# Altium project StenoBoard_L.PrjPcb
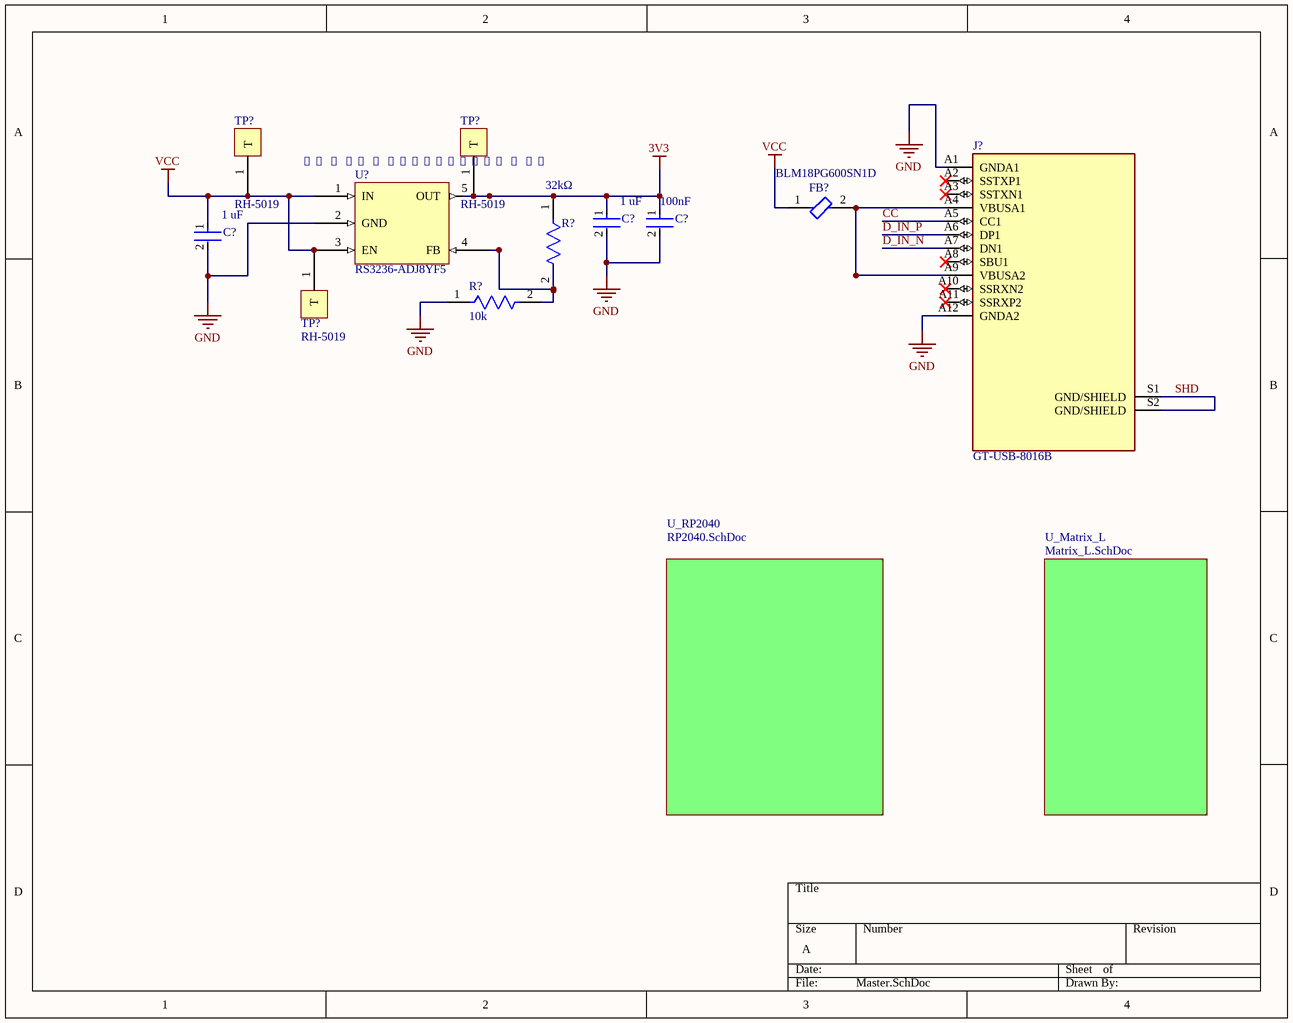
[diagram p0: Master.SchDoc]
3 sheets, 31 parts. Net scope: flat (ports and power ports of the same name join across sheets).
Sheets:
  Master.SchDoc
    U_Matrix_L = Matrix_L.SchDoc
    U_RP2040 = RP2040.SchDoc

## Sheet Master.SchDoc
size A; SheetNumber: 1; SheetTotal: 3

### Parts
(Parts that share a designator on the sheet are numbered #1, #2 ... from top to bottom, then left to right.)
C?#1  value 1 uF  [FP-CC0603-DA-MFG]  (hidden comment: CC0603KRX7R7BB105)
C?#2  Capacitance: 100nF  [FP-GRM155-0_05-MFG]  (hidden comment: GRM155R71C104KA88J)
C?#3  value 1 uF  [FP-CC0603-DA-MFG]  (hidden comment: CC0603KRX7R7BB105)
FB?  BLM18PG600SN1D  [FP-BLM18-0_15-t0_8-IPC_B]
J?  GT-USB-8016B  [BELFUSE_SS-52400-002]
R?#1  Resistance: 32kΩ  [FP-RT0603-0_55-MFG]  (hidden comment: RT0603BRD0732KL)
R?#2  Resistance: 10k  [FP-RC0603-0_55-IPC_C]  (hidden comment: RC0603FR-0710KL)
TP?#1  RH-5019  [RH-5019-Footprint-1]
TP?#2  RH-5019  [RH-5019-Footprint-1]
TP?#3  RH-5019  [RH-5019-Footprint-1]
U?#1  RS3236-ADJ8YF5  [SOT95P245X110-5N]

### Sub-sheets
U_Matrix_L = Matrix_L.SchDoc: no entries
U_RP2040 = RP2040.SchDoc: no entries

### Nets
3V3: C?#1.1 C?#2.1 R?#1.1 TP?#2.1(T) U?#1.5(OUT)
GND: C?#1.2 C?#2.2 C?#3.2 J?.A1(GNDA1) J?.A12(GNDA2) R?#2.1 U?#1.2(GND)
VCC: C?#3.1 FB?.1 TP?#1.1(T) TP?#3.1(T) U?#1.1(IN) U?#1.3(EN)
CC: J?.A5(CC1)
D_IN_N: J?.A7(DN1)
D_IN_P: J?.A6(DP1)
SHD: J?.S1(GND/SHIELD) J?.S2(GND/SHIELD)
NetFB?_2: FB?.2 J?.A4(VBUSA1) J?.A9(VBUSA2)
NetR?#1_2: R?#1.2 R?#2.2 U?#1.4(FB)

Not connected (* = marked no-connect by the designer): J? A2(SSTXP1)* A3(SSTXN1)* A8(SBU1)* A10(SSRXN2)* A11(SSRXP2)*

### Notes on the sheet
- 𝑅1 = 𝑅2 ∗ (VOUT/0.81 - 1)

### Library data of the parts
C?#1 C?#3 = CMP-03422-000924-1: CAP CER 1UF 16V X7R 0603; Manufacturer: YAGEO; Tolerance: 0.1; Temperature Coefficient: 15%; Material: Ceramic; Package: CC0603-DA; RoHS: TRUE; Device Class L2: Capacitors; Temperature Characteristic: X7R; Temperature: -55°C to +125°C; Temperature Range Low: -55°C; Automotive: No; ComponentLink2Description: Datasheet; Lead Free: Yes; Capacitance: 1 uF; ComponentLink2URL: http://www.yageo.com/documents/recent/UPY-GPHC_X7R_6.3V-to-50V_18.pdf; Device Class L1: Passive Components; Voltage: 16 V; Octopart: https://octopart.com/cc0603krx7r7bb105-yageo-42271928; Category: Cap; Digikey Description: CAP CER 1UF 16V X7R 0603; Footprint Url: http://www.yageo.com/exep/pages/download/literatures/UPY-C_GEN_24.pdf; Height: 0.9mm; Manufacturer Part Number: CC0603KRX7R7BB105; Voltage Rating: 16 V; Temperature Range High: +125°C; Mouser Description: Multilayer Ceramic Capacitor, CC Series, 1 - F, - 10%, X7R, 16 V, 0603 [1608 Metric]; Device Class L3: Ceramic Capacitors
C?#2 = CMP-2008-03928-2: NexarPartId: 9223238; Manufacturer Lifecycle Status: NRND; Voltage: 16V; Tolerance: 10%; Dielectric: X7R; Material: Ceramic; Schedule B: 8532240020, 8532240020; Mount: Surface Mount; Case/Package: 0402; Case Code (Imperial): 0402; Min Operating Temperature: -55°C; Length: 1mm; Voltage Rating (DC): 16V; Depth: 500µm; Lead Free: Lead Free; Max Operating Temperature: 125°C; Case Code (Metric): 1005; Radiation Hardening: No; Height: 550µm; Voltage Rating: 16V; Packaging: Cut Tape; RoHS: Compliant; Width: 500µm; Number of Pins: 2; REACH SVHC: No SVHC; Termination: SMD/SMT; Thickness: 500µm
FB? = CMP-0686-00575-3: Chip Ferrite Bead, 0603, 60Ω @ 100MHz, 0.1Ω, , 1A; ESR (Equivalent Series Resistance): 60R; Number of Lines: 1; Material: Steel; Tolerance: 25%; Shielding: Unshielded; Current Rating: 500mA; Resistance: 100mR; Package Quantity: 1; Termination: SMD/SMT; Lead Free: Lead Free; Max Operating Temperature: 125°C; Number of Circuits: 1; Length: 1.6mm; Min Operating Temperature: -55°C; Case Code (Metric): 1608; Max DC Current: 500mA; REACH SVHC: No SVHC; Frequency: 100MHz; Number of Pins: 2; RoHS Compliant: Yes; Height: 0.8mm; Depth: 0.8mm; Width: 0.8mm; Test Frequency: 100MHz; Case/Package: 0603; Impedance: 60R; Max Current Rating: 500mA; Packaging: Tape and Reel; DC Resistance (DCR): 100mR; Case Code (Imperial): 0603; Core Material: Ferrite
J? = CMP-002-00071-2: USB C 2.0 Plug
R?#1 = CMP-00621-34935746-1: RT0603BRD0732KL High Precision-High Stability Chip Resistor Thin Film 0603 32kOhm 0.1% Paper T/R; Temperature Coefficient: 25ppm/°C; Max Power Dissipation: 100mW; Case/Package: 0603; Composition: Thin Film; Features: Moisture Resistant; Packaging: Tape & Reel; RoHS: Compliant; Height: 558.8µm; Max Operating Temperature: 155°C; NexarPartId: 34935746; Number of Terminations: 2; Length: 1.6002mm; Width: 787.4µm; Tolerance: 0.1%; Min Operating Temperature: -55°C
R?#2 = CMP-2100-03664-2: RES 10K OHM 1% 1/10W 0603; Voltage Rating: 75V; Voltage Rating (DC): 50V; Power Rating: 100mW; Temperature Coefficient: 100ppm/°C; Depth: 0.8mm; Termination: SMD/SMT; Resistor Type: Thick Film; Series: RC; Construction: Rectangular; Features: Moisture Resistant; Packaging: Tape and Reel; Min Operating Temperature: -55°C; Number of Terminations: 2; Lead Pitch: 0.3mm; RoHS Compliant: Yes; Case/Package: 0603; Resistance Tolerance: 1%; Military Standard: Not; Weight: 7.1E-05oz; Number of Pins: 2; Tolerance: 1%; Length: 1.6mm; Case Code (Imperial): 0603; Lead Free: Lead Free; Width: 0.8mm; Max Power Dissipation: 100mW; Height: 0.45mm; Max Operating Temperature: 155°C; Case Code (Metric): 1608; Size Code: 0603
TP?#1-TP?#3 = CMP-00030-00001-2: PC Test Point
U?#1 = CMP-019-00049-2: IC Reg Lin Pos Adj 500MA SOT23-5

## Sheet Matrix_L.SchDoc
size A; SheetNumber: 2; SheetTotal: 2

## Sheet RP2040.SchDoc
size A; SheetNumber: 3; SheetTotal: 3
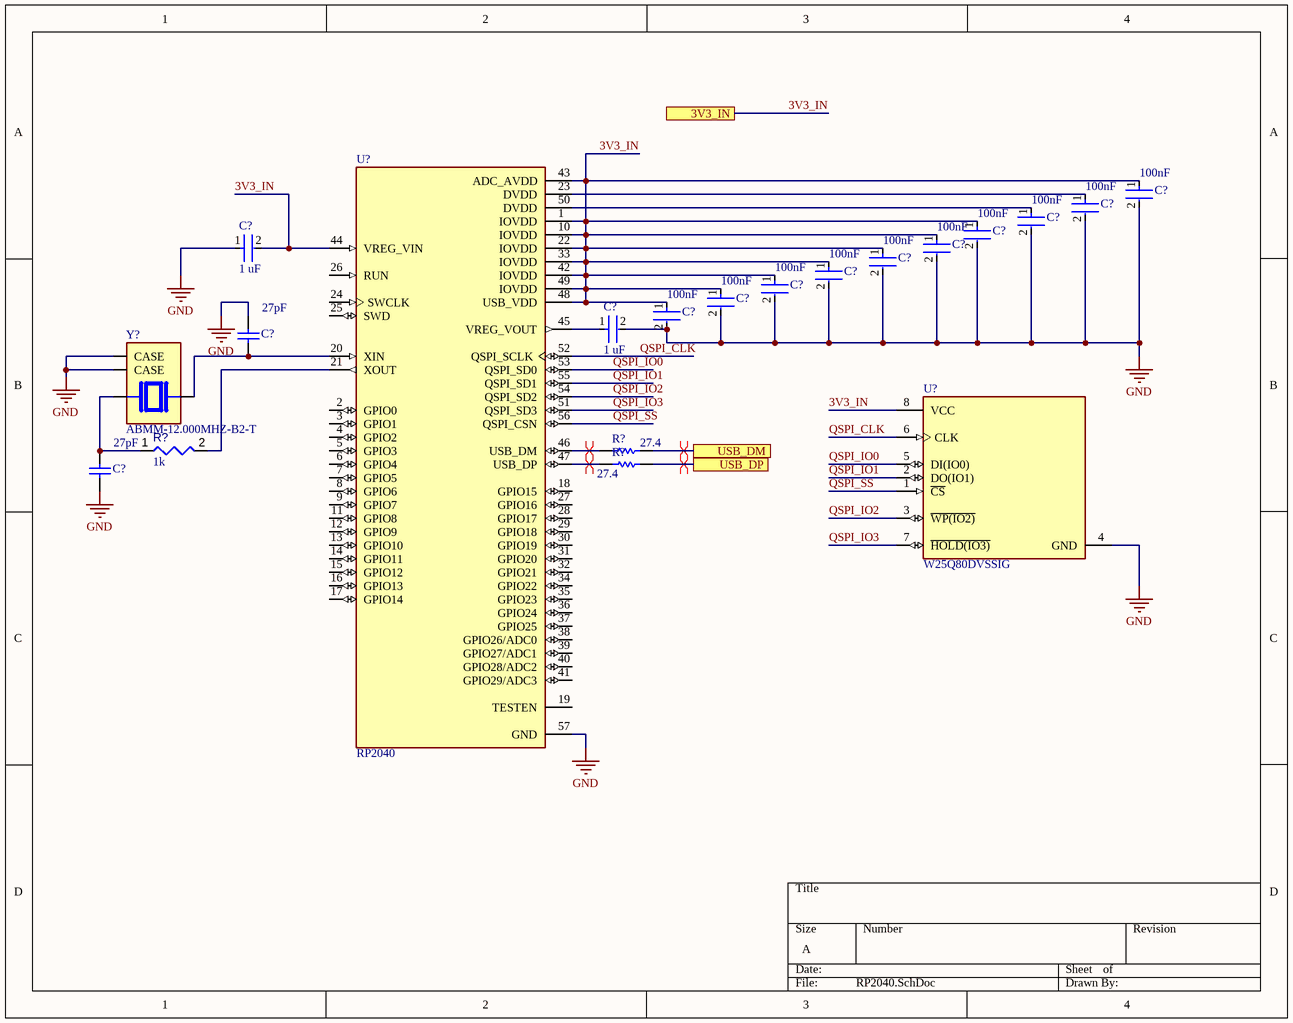
[diagram p1: RP2040.SchDoc]

### Parts
(Parts that share a designator on the sheet are numbered #1, #2 ... from top to bottom, then left to right.)
C?#4  Capacitance: 100nF  [FP-GRM155-0_05-MFG]  (hidden comment: GRM155R71C104KA88J)
C?#5  Capacitance: 100nF  [FP-GRM155-0_05-MFG]  (hidden comment: GRM155R71C104KA88J)
C?#6  Capacitance: 100nF  [FP-GRM155-0_05-MFG]  (hidden comment: GRM155R71C104KA88J)
C?#7  Capacitance: 100nF  [FP-GRM155-0_05-MFG]  (hidden comment: GRM155R71C104KA88J)
C?#8  Capacitance: 100nF  [FP-GRM155-0_05-MFG]  (hidden comment: GRM155R71C104KA88J)
C?#9  value 1 uF  [FP-CC0603-DA-MFG]  (hidden comment: CC0603KRX7R7BB105)
C?#10  Capacitance: 100nF  [FP-GRM155-0_05-MFG]  (hidden comment: GRM155R71C104KA88J)
C?#11  Capacitance: 100nF  [FP-GRM155-0_05-MFG]  (hidden comment: GRM155R71C104KA88J)
C?#12  Capacitance: 100nF  [FP-GRM155-0_05-MFG]  (hidden comment: GRM155R71C104KA88J)
C?#13  Capacitance: 100nF  [FP-GRM155-0_05-MFG]  (hidden comment: GRM155R71C104KA88J)
C?#14  Capacitance: 100nF  [FP-GRM155-0_05-MFG]  (hidden comment: GRM155R71C104KA88J)
C?#15  value 27pF  [CAPC1005X55X25LL05T10]  (hidden comment: GRM1555C1H270JA01D)
C?#16  value 1 uF  [FP-CC0603-DA-MFG]  (hidden comment: CC0603KRX7R7BB105)
C?#17  value 27pF  [CAPC1005X55X25LL05T10]  (hidden comment: GRM1555C1H270JA01D)
R?#3  value 27.4  [RESC1005X40X25ML05T10]  (hidden comment: RC0402FR-0727R4L)
R?#4  value 1k  [RESC1005X40X25ML10T10]  (hidden comment: Resistor 1k +/-5% 0402 63 mW)
R?#5  value 27.4  [RESC1005X40X25ML05T10]  (hidden comment: RC0402FR-0727R4L)
U?#2  W25Q80DVSSIG  [FP-SS-MFG]
U?#3  RP2040  [QFN40P700X700X90-57N]
Y?  ABMM-12.000MHZ-B2-T  [XTAL_ABMM-12.000MHZ-B2-T]

### Ports
3V3_IN, USB_DM, USB_DP

### Nets
GND: C?#4.2 C?#5.2 C?#6.2 C?#7.2 C?#8.2 C?#9.1 C?#10.2 C?#11.2 C?#12.2 C?#13.2 C?#14.2 C?#15.1 C?#16.2 C?#17.2 U?#2.4(GND) U?#3.57(GND) Y?.2(CASE) Y?.4(CASE)
3V3_IN: C?#4.1 C?#7.1 C?#8.1 C?#9.2 C?#10.1 C?#11.1 C?#12.1 C?#13.1 C?#14.1 U?#2.8(VCC) U?#3.1(IOVDD) U?#3.10(IOVDD) U?#3.22(IOVDD) U?#3.33(IOVDD) U?#3.42(IOVDD) U?#3.43(ADC_AVDD) U?#3.44(VREG_VIN) U?#3.48(USB_VDD) U?#3.49(IOVDD) ; port 3V3_IN
QSPI_CLK: U?#2.6(CLK) U?#3.52(QSPI_SCLK)
QSPI_IO0: U?#2.5(DI(IO0)) U?#3.53(QSPI_SD0)
QSPI_IO1: U?#2.2(DO(IO1)) U?#3.55(QSPI_SD1)
QSPI_IO2: U?#2.3(~{WP(IO2)}) U?#3.54(QSPI_SD2)
QSPI_IO3: U?#2.7(~{HOLD(IO3)}) U?#3.51(QSPI_SD3)
QSPI_SS: U?#2.1(~{CS}) U?#3.56(QSPI_CSN)
NetC?#5_1: C?#5.1 U?#3.23(DVDD)
NetC?#6_1: C?#6.1 U?#3.50(DVDD)
NetC?#15_2: C?#15.2 U?#3.20(XIN) Y?.1
NetC?#16_1: C?#16.1 U?#3.45(VREG_VOUT)
NetC?#17_1: C?#17.1 R?#4.1 Y?.3
NetR?#3_1: R?#3.1 U?#3.46(USB_DM)
NetR?#3_2: R?#3.2 ; port USB_DM
NetR?#4_2: R?#4.2 U?#3.21(XOUT)
NetR?#5_1: R?#5.1 U?#3.47(USB_DP)
NetR?#5_2: R?#5.2 ; port USB_DP

Not connected (* = marked no-connect by the designer): U?#3 2(GPIO0) 3(GPIO1) 4(GPIO2) 5(GPIO3) 6(GPIO4) 7(GPIO5) 8(GPIO6) 9(GPIO7) 11(GPIO8) 12(GPIO9) 13(GPIO10) 14(GPIO11) 15(GPIO12) 16(GPIO13) 17(GPIO14) 18(GPIO15) 19(TESTEN) 24(SWCLK) 25(SWD) 26(RUN) 27(GPIO16) 28(GPIO17) 29(GPIO18) 30(GPIO19) 31(GPIO20) 32(GPIO21) 34(GPIO22) 35(GPIO23) 36(GPIO24) 37(GPIO25) 38(GPIO26/ADC0) 39(GPIO27/ADC1) 40(GPIO28/ADC2) 41(GPIO29/ADC3)

### Layout directives
differential pair: NetR?#3_1, NetR?#3_2, NetR?#5_1, NetR?#5_2

### Library data of the parts
C?#4-C?#8 C?#10-C?#14 = CMP-2008-03928-2: as C?#2 on sheet Master; Schedule B: 8532240020, 8532240020; Mount: Surface Mount; Case/Package: 0402; Case Code (Imperial): 0402; Min Operating Temperature: -55°C; Length: 1mm; Voltage Rating (DC): 16V; Depth: 500µm; Lead Free: Lead Free; Max Operating Temperature: 125°C; Case Code (Metric): 1005; Radiation Hardening: No; Height: 550µm; Voltage Rating: 16V; Packaging: Cut Tape; RoHS: Compliant; Width: 500µm; Number of Pins: 2; REACH SVHC: No SVHC; Termination: SMD/SMT; Thickness: 500µm
C?#9 C?#16 = CMP-03422-000924-1: as C?#1 on sheet Master; Package: CC0603-DA; RoHS: TRUE; Device Class L2: Capacitors; Temperature Characteristic: X7R; Temperature: -55°C to +125°C; Temperature Range Low: -55°C; Automotive: No; ComponentLink2Description: Datasheet; Lead Free: Yes; Capacitance: 1 uF; ComponentLink2URL: http://www.yageo.com/documents/recent/UPY-GPHC_X7R_6.3V-to-50V_18.pdf; Device Class L1: Passive Components; Voltage: 16 V; Octopart: https://octopart.com/cc0603krx7r7bb105-yageo-42271928; Category: Cap; Digikey Description: CAP CER 1UF 16V X7R 0603; Footprint Url: http://www.yageo.com/exep/pages/download/literatures/UPY-C_GEN_24.pdf; Height: 0.9mm; Manufacturer Part Number: CC0603KRX7R7BB105; Voltage Rating: 16 V; Temperature Range High: +125°C; Mouser Description: Multilayer Ceramic Capacitor, CC Series, 1 - F, - 10%, X7R, 16 V, 0603 [1608 Metric]; Device Class L3: Ceramic Capacitors
C?#15 C?#17 = CMP-2008-03917-1: Manufacturer: Murata; Part Number: GRM1555C1H270JA01D
R?#3 R?#5 = CMP-2002-07553-1: Manufacturer: Yageo / Phycomp; Part Number: RC0402FR-0727R4L
R?#4 = CMP-009-00013-5: Chip Resistor, 1 KOhm, +/- 5%, 0.063 W, -55 to 155 degC, 0402 (1005 Metric); Power: 63mW; Tolerance: 5%; Case/Package: 0402; Mounting Technology: SM; Min Operating Temperature: -55°C; Pins: 2; Max Operating Temperature: 155°C; RoHS Compliant: True
U?#2 = CMP-2000-07408-2: IC FLASH 8MBIT SPI 104MHZ 8SOIC; Memory Type: Non-Volatile; Memory Size: 8Mb; Frequency: 104MHz; Min Operating Temperature: -40°C; Mount: Surface Mount; RoHS Compliant: Yes; Packaging: Rail/Tube; Case/Package: SOIC; Max Operating Temperature: 85°C; Series: SpiFlash®; Interface: SPI
U?#3 = CMP-027-000000-1: RP2040 chip for Raspberry Pi Pico - ARM® Cortex®-M0+ MCU 32-Bit; MP: RP2040; Design Item ID: RP2040; SnapEDA_Link: https://www.snapeda.com/parts/RP2040/Raspberry+Pi/view-part/?ref=snap; Source: RP2040.SchLib; Pin Count: 57; Value: *; Component Type: Standard; MF: Raspberry Pi; Package: None; Check_prices: https://www.snapeda.com/parts/RP2040/Raspberry+Pi/view-part/?ref=eda
Y? = CMP-032-000000-1: Availability: Unavailable; Package: None; Price: None; Source: ABMM-12.000MHZ-B2-T.SchLib; Component Type: Standard; MP: ABMM-12.000MHZ-B2-T; Pin Count: 4; Value: *; Design Item ID: ABMM-12.000MHZ-B2-T

## Nets that join several sheets
GND: Master (7 pins), RP2040 (18 pins)